# EAGLE schematic mainboard_transmitter.vf0.1 (EAGLE 6.5.0)
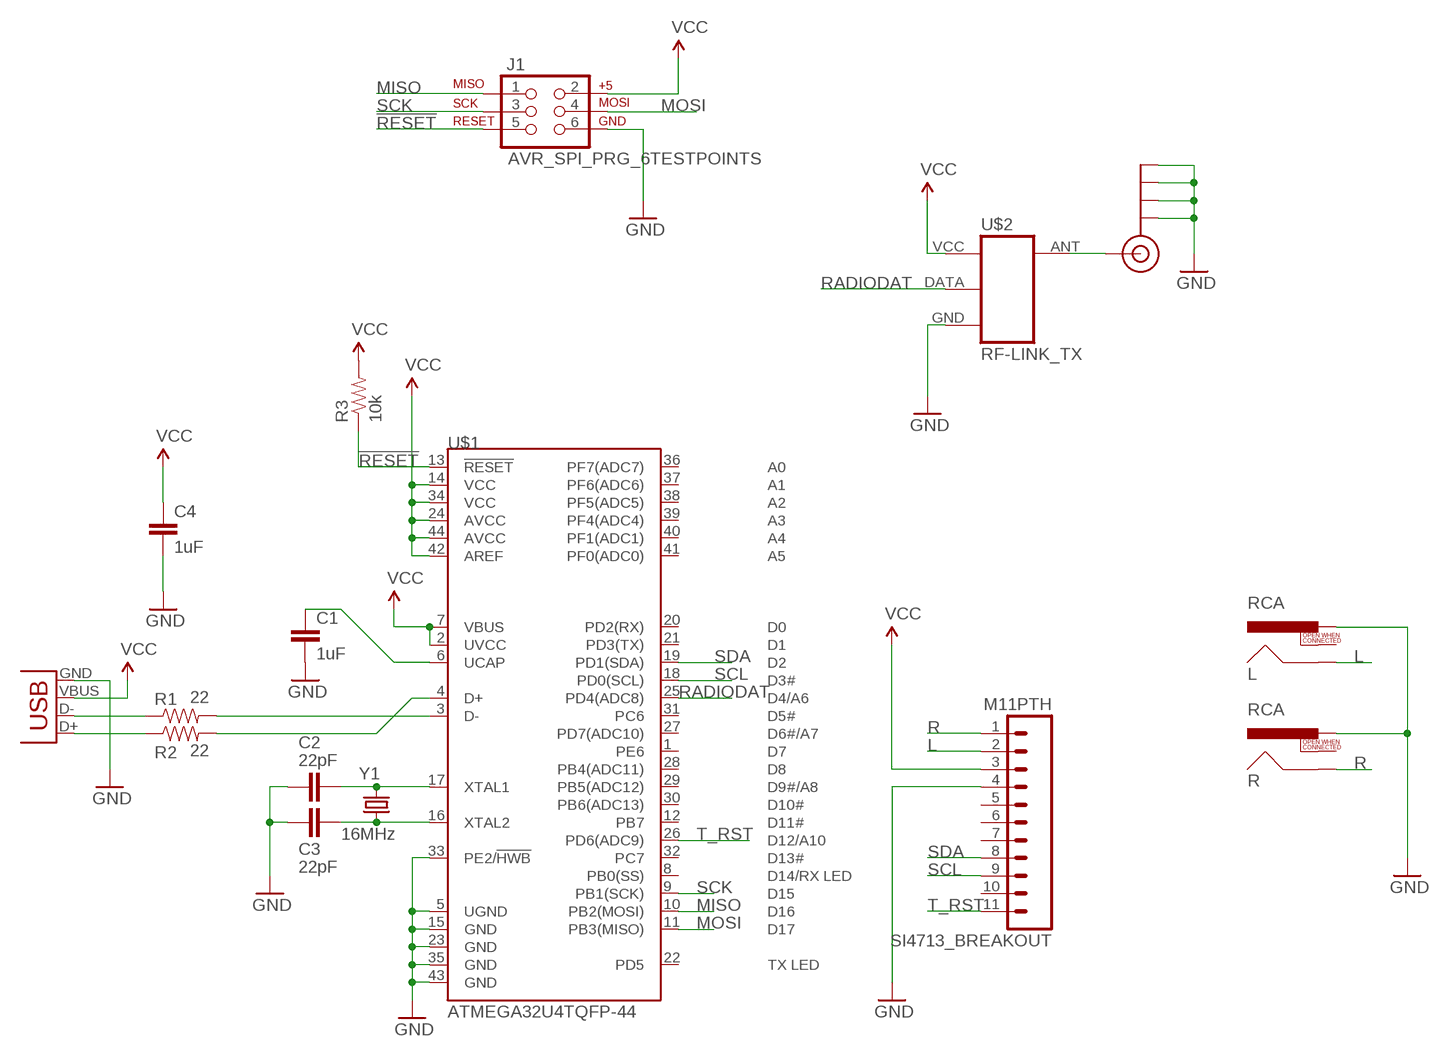
[diagram p0: schematic, sheet 1]

## Parts
C1  1uF  CAPPTH  [CAP-PTH-SMALL]
C2  22pF  CAPPTH  [CAP-PTH-SMALL]
C3  22pF  CAPPTH  [CAP-PTH-SMALL]
C4  1uF  CAPPTH  [CAP-PTH-SMALL]
J1  AVR_SPI_PRG_6TESTPOINTS  [2X3_TEST_POINTS]
J$1  SMA_EDGE  [SMA-EDGE]
JP1  USB-B  USBPTH  [USB-B-PTH]
L  RCA  [RCA]
R  RCA  [RCA]
R1  22  RESISTORPTH-1/4W-VERT  [AXIAL-0.1]
R2  22  RESISTORPTH-1/4W-VERT  [AXIAL-0.1]
R3  10k  10KOHM-1/4W5%(PTH)VERT  [AXIAL-0.1]
SI4713_BREAKOUT  M11PTH  [1X11]
U$1  ATMEGA32U4TQFP-44  [TQFP44]
U$2  RF-LINK_TX  [RF-LINK_TX]
Y1  16MHz  CRYSTALHC49US  [HC49US]

## Nets
!RESET: J1.5 R3.P$1 U$1.13(!RESET)
GND: C1.2 C2.1 C3.1 C4.2 J1.6 J$1.GND@0(GND) J$1.GND@1(GND) J$1.GND@2(GND) J$1.GND@3(GND) JP1.GND L.PIN R.PIN SI4713_BREAKOUT.4 U$1.5(UGND) U$1.15(GND) U$1.23(GND) U$1.33(PE2/!HWB) U$1.35(GND) U$1.43(GND) U$2.GND
L: L.SHELL SI4713_BREAKOUT.2
MISO: J1.1 U$1.10(PB2(MOSI))
MOSI: J1.4 U$1.11(PB3(MISO))
N$1: JP1.D+ R2.P$1
N$2: JP1.D- R1.P$1
N$3: R1.P$2 U$1.3(D-)
N$4: R2.P$2 U$1.4(D+)
N$5: C1.1 U$1.6(UCAP)
N$6: C2.2 U$1.17(XTAL1) Y1.2
N$7: C3.2 U$1.16(XTAL2) Y1.1
N$9: J$1.SIG(SIGNAL) U$2.ANT
R: R.SHELL SI4713_BREAKOUT.1
RADIODAT: U$1.25(PD4(ADC8)) U$2.DATA
SCK: J1.3 U$1.9(PB1(SCK))
SCL: SI4713_BREAKOUT.9 U$1.18(PD0(SCL))
SDA: SI4713_BREAKOUT.8 U$1.19(PD1(SDA))
T_RST: SI4713_BREAKOUT.11 U$1.26(PD6(ADC9))
VCC: C4.1 J1.2 JP1.VBUS R3.P$2 SI4713_BREAKOUT.3 U$1.2(UVCC) U$1.7(VBUS) U$1.14(VCC) U$1.24(AVCC) U$1.34(VCC) U$1.42(AREF) U$1.44(AVCC) U$2.VCC(+5V)
Unconnected: L.SWITCH R.SWITCH SI4713_BREAKOUT.5 SI4713_BREAKOUT.6 SI4713_BREAKOUT.7 SI4713_BREAKOUT.10 U$1.1(PE6) U$1.8(PB0(SS)) U$1.12(PB7) U$1.20(PD2(RX)) U$1.21(PD3(TX)) U$1.22(PD5) U$1.27(PD7(ADC10)) U$1.28(PB4(ADC11)) U$1.29(PB5(ADC12)) U$1.30(PB6(ADC13)) U$1.31(PC6) U$1.32(PC7) U$1.36(PF7(ADC7)) U$1.37(PF6(ADC6)) U$1.38(PF5(ADC5)) U$1.39(PF4(ADC4)) U$1.40(PF1(ADC1)) U$1.41(PF0(ADC0))

## Library data of the parts
C1-C4 = SparkFun-Capacitors:CAP: Capacitor Standard 0603 ceramic capacitor, and 0.1" leaded capacitor.
J1 = SparkFun-Connectors:AVR_SPI_PRG_6: AVR ISP 6 Pin This is the reduced ISP connector for AVR programming. Common on Arduino. This footprint will take up less PCB space and can be used with a 10-pin to 6-pin adapter such as SKU: BOB-08508 **Special note about "TEST_POINT" package. The stop mask is on the top side, so if you want your programming test points to be on the bottom of your board, make sure to place this package on the bottom side of the board. This also ensure that the orientation to program from the bottom side will be correct.
J$1 = SparkFun-Connectors:SMA_EDGE: SMA Antenna Connector End launch SMA connector. The paste layer has been removed so that the connector can be hand soldered onto the board after reflow.
JP1 = SparkFun-Connectors:USB: USB Connectors USB-B-PTH is fully proven SKU : PRT-00139/CONN-08278 USB-miniB is fully proven SKU : PRT-00587 USB-A-PCB is untested. USB-A-H is throughly reviewed, but untested. Spark Fun Electronics SKU : PRT-00437 USB-B-SMT is throughly reviewed, but untested. Needs silkscreen touching up. USB-A-S has not been used/tested USB-MB-H has not been used/tested USB-MICROB has been used. CONN-09505; PROD_ID: CONN-08278
L R = SparkFun-Connectors:RCA
R1 R2 = SparkFun-Resistors:RESISTOR: Resistor Basic schematic elements and footprints for 0603, 1206, and PTH resistors.
R3 = SparkFun-Resistors:10KOHM-1/4W5%(PTH): RES-09435; PROD_ID: RES-9435
SI4713_BREAKOUT = SparkFun-Connectors:M11: Header 11 Standard 11-pin 0.1" header. Use with straight break away headers (SKU : PRT-00116), right angle break away headers (PRT-00553), swiss pins (PRT-00743), machine pins (PRT-00117), and female headers (PRT-00115).
U$1 = SparkFun-DigitalIC:ATMEGA32U4: Atmel 44-pin 8-bit Microcontroller with 32KBytes of ISP Flash and USB Controller
U$2 = SparkFun-RF:RF-LINK_TX: RF Link transmitters WRL-8945, 8946
Y1 = SparkFun-FreqCtrl:CRYSTAL: Various standard crystals. Proven footprints. Spark Fun Electronics SKU : COM-00534